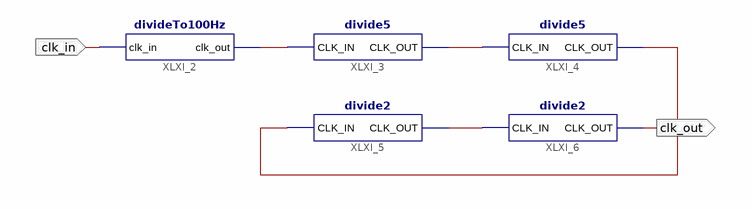
[diagram p0: schematic sheet 1]
// Xilinx ISE schematic divideTo1Hz.sch (spartan6) as structural Verilog: 5 symbols, 2 ports
module divideTo1Hz (
  input  clk_in,
  output clk_out
);

  wire XLXN_1, XLXN_2, XLXN_3, XLXN_4;

  divideTo100Hz XLXI_2 (.clk_in(clk_in), .clk_out(XLXN_1));
  divide5 XLXI_3 (.CLK_IN(XLXN_1), .CLK_OUT(XLXN_2));
  divide5 XLXI_4 (.CLK_IN(XLXN_2), .CLK_OUT(XLXN_3));
  divide2 XLXI_5 (.CLK_IN(XLXN_3), .CLK_OUT(XLXN_4));
  divide2 XLXI_6 (.CLK_IN(XLXN_4), .CLK_OUT(clk_out));
endmodule
